# EAGLE design PCB (EAGLE 9.0.1)
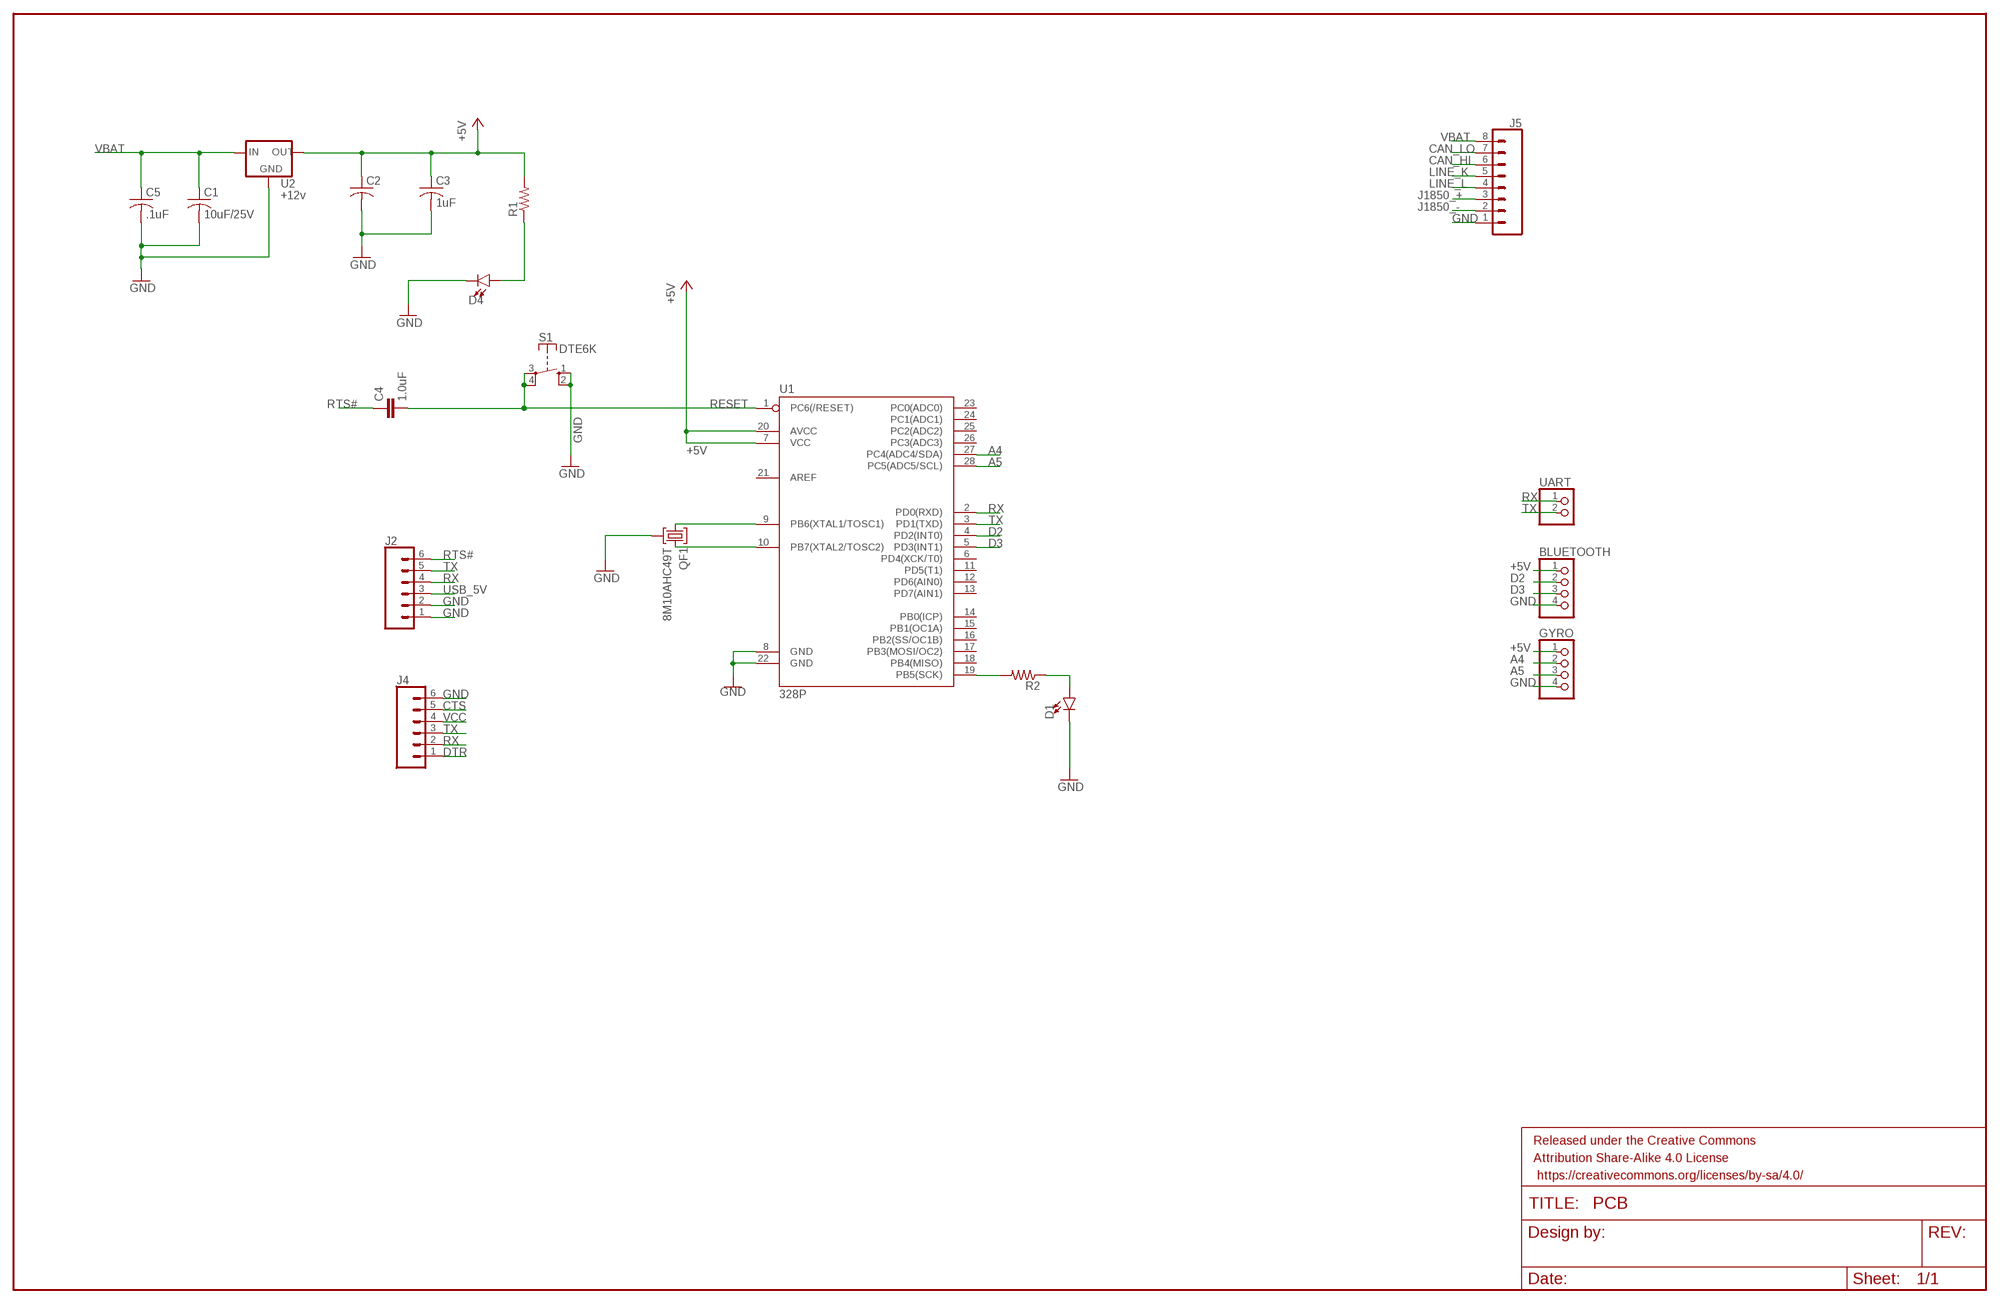
[diagram p0: schematic, sheet 1]

## Parts
BLUETOOTH  PINHD-1X4  [1X04]
C1  10uF/25V  C-US050-025X075  [C050-025X075]
C2  C-US050-025X075  [C050-025X075]
C3  1uF  C-US050-025X075  [C050-025X075]
C4  1.0uF  1.0UF-1206-50V-10%  [1206]
C5  .1uF  C-US050-025X075  [C050-025X075]
D1  LED3MM  [LED_3MM]
D4  LED3MM  [LED_3MM]
FRAME1  FRAME-LEDGER  [CREATIVE_COMMONS]
GYRO  PINHD-1X4  [1X04]
J2  CONN_06LONGPADS  [1X06_LONGPADS]
J4  CONN_06LONGPADS  [1X06_LONGPADS]
J5  CONN_08LONGPADS  [1X08_LONGPADS]
QF1  8M10AHC49T  [HC49U]
R1  R-US_0204/5  [0204/5]
R2  R-US_0204/5  [0204/5]
S1  DTE6K  [DTE6K]
U1  328P  ATMEGA328P_PDIP  [DIP28]
U2  +12v  V_REG_78XX7812  [TO-252]
UART  PINHD-1X2  [1X02]

## Nets
+5V: BLUETOOTH.1 C2.1 C3.1 GYRO.1 R1.2 U1.7(VCC) U1.20(AVCC) U2.2(OUT)
A4: GYRO.2 U1.27(PC4(ADC4/SDA))
A5: GYRO.3 U1.28(PC5(ADC5/SCL))
CAN_HI: J5.6
CAN_LO: J5.7
CTS: J4.5
D2: BLUETOOTH.2 U1.4(PD2(INT0))
D3: BLUETOOTH.3 U1.5(PD3(INT1))
DTR: J4.1
GND: BLUETOOTH.4 C1.2 C2.2 C3.2 C5.2 D1.K(C) D4.K(C) GYRO.4 J2.1 J2.2 J4.6 J5.1 QF1.2 S1.1(S) S1.2(S) U1.8(GND) U1.22(GND) U2.3(GND)
J1850_+: J5.3
J1850_-: J5.2
LINE_K: J5.5
LINE_L: J5.4
N$1: QF1.1 U1.9(PB6(XTAL1/TOSC1))
N$2: QF1.3 U1.10(PB7(XTAL2/TOSC2))
N$4: R2.2 U1.19(PB5(SCK))
N$5: D1.A R2.1
N$22: D4.A R1.1
RESET: C4.2 S1.3(P) S1.4(P) U1.1(PC6(/RESET))
RTS#: C4.1 J2.6
RX: J2.4 J4.2 U1.2(PD0(RXD)) UART.1
TX: J2.5 J4.3 U1.3(PD1(TXD)) UART.2
USB_5V: J2.3
VBAT: C1.1 C5.1 J5.8 U2.1(IN)
VCC: J4.4
Unconnected: U1.6(PD4(XCK/T0)) U1.11(PD5(T1)) U1.12(PD6(AIN0)) U1.13(PD7(AIN1)) U1.14(PB0(ICP)) U1.15(PB1(OC1A)) U1.16(PB2(SS/OC1B)) U1.17(PB3(MOSI/OC2)) U1.18(PB4(MISO)) U1.21(AREF) U1.23(PC0(ADC0)) U1.24(PC1(ADC1)) U1.25(PC2(ADC2)) U1.26(PC3(ADC3))

## Library data of the parts
BLUETOOTH GYRO = pinhead:PINHD-1X4: PIN HEADER
C1-C3 C5 = resistor:C-US: CAPACITOR, American symbol
C4 = SparkFun-Capacitors:1.0UF: 1µF ceramic capacitors A capacitor is a passive two-terminal electrical component used to store electrical energy temporarily in an electric field.; PROD_ID: CAP-09822
D1 D4 = SparkFun-LED:LED: LED (Generic) Standard schematic elements and footprints for 5mm, 3mm, 1206, and 0603 sized LEDs. Generic LEDs with no color specified.; PROD_ID: DIO-08794
FRAME1 = SparkFun-Aesthetics:FRAME-LEDGER: Schematic Frame - Ledger Standard 11x14 US Ledger frame
J2 J4 = SparkFun-Connectors:CONN_06: Multi connection point. Often used as Generic Header-pin footprint for 0.1 inch spaced/style header connections On any of the 0.1 inch spaced packages, you can populate with these: Break Away Headers - Straight <https://www.sparkfun.com/products/116> (PRT-00116) Break Away Male Headers - Right Angle <https://www.sparkfun.com/products/553> (PRT-00553) Female Headers <https://www.sparkfun.com/products/115> (PRT-00115) Break Away Headers - Machine Pin <https://www.sparkfun.com/products/117> (PRT-00117) Break Away Female Headers - Swiss Machine Pin <https://www.sparkfun.com/products/743> (PRT-00743) Arduino Stackable Header - 6 Pin <https://www.sparkfun.com/products/9280> (PRT-09280) For SCREWTERMINALS and SPRING TERMINALS visit here: Screw Terimnals on SparkFun.com <https://www.sparkfun.com/search/results?term=Screw+Terminals> (5mm/3.5mm/2.54mm spacing) This device is also useful as a general connection point to wire up your design to another part of your project. Our various solder wires solder well into these plated through hole pads. Hook-Up Wire - Assortment (Stranded, 22 AWG) <https://www.sparkfun.com/products/11375> (PRT-11375) Hook-Up Wire - Assortment (Solid Core, 22 AWG) <https://www.sparkfun.com/products/11367> (PRT-11367) View the entire wire category on our website here <https://www.sparkfun.com/categories/141>
J5 = SparkFun-Connectors:CONN_08: Multi connection point. Often used as Generic Header-pin footprint for 0.1 inch spaced/style header connections On any of the 0.1 inch spaced packages, you can populate with these: Break Away Headers - Straight <https://www.sparkfun.com/products/116> (PRT-00116) Break Away Male Headers - Right Angle <https://www.sparkfun.com/products/553> (PRT-00553) Female Headers <https://www.sparkfun.com/products/115> (PRT-00115) Break Away Headers - Machine Pin <https://www.sparkfun.com/products/117> (PRT-00117) Break Away Female Headers - Swiss Machine Pin <https://www.sparkfun.com/products/743> (PRT-00743) Arduino Stackable Header - 8 Pin <https://www.sparkfun.com/products/9279> (PRT-09279) For SCREWTERMINALS and SPRING TERMINALS visit here: Screw Terimnals on SparkFun.com <https://www.sparkfun.com/search/results?term=Screw+Terminals> (5mm/3.5mm/2.54mm spacing) This device is also useful as a general connection point to wire up your design to another part of your project. Our various solder wires solder well into these plated through hole pads. Hook-Up Wire - Assortment (Stranded, 22 AWG) <https://www.sparkfun.com/products/11375> (PRT-11375) Hook-Up Wire - Assortment (Solid Core, 22 AWG) <https://www.sparkfun.com/products/11367> (PRT-11367) View the entire wire category on our website here <https://www.sparkfun.com/categories/141> Special notes: Molex polarized connector foot print use with SKU : PRT-08231 with associated crimp pins and housings. 1MM SMD Version SKU: PRT-10208 NOTES ON THE VARIANTS LOCK and LOCK_LONGPADS... This footprint was designed to help hold the alignment of a through-hole component (i.e. 6-pin header) while soldering it into place. You may notice that each hole has been shifted either up or down by 0.005 of an inch from it's more standard position (which is a perfectly straight line). This slight alteration caused the pins (the squares in the middle) to touch the edges of the holes. Because they are alternating, it causes a "brace" to hold the component in place. 0.005 has proven to be the perfect amount of "off-center" position when using our standard breakaway headers. Although looks a little odd when you look at the bare footprint, once you have a header in there, the alteration is very hard to notice. Also,if you push a header all the way into place, it is covered up entirely on the bottom side.
QF1 = crystal:8M10AHC49T: Monolithic Crystal Filters Source: www.vanlong.com; OC_FARNELL: unknown; OC_NEWARK: unknown
R1 R2 = resistor:R-US_: RESISTOR, American symbol
S1 = switch-misc:DT: ITT SWITCH
U1 = SparkFun-IC-Microcontroller:ATMEGA328P_PDIP: Atmel 328P Through hole ATMEGA328P uC used in the Arduino 32kb flash, 1k EEPROM, 2k SRAM Datasheet <http://www.sparkfun.com/datasheets/Components/SMD/ATMega328.pdf> SparkFun Products Storefront component: AVR 28 Pin 20MHz 32K 6A/D - ATMega328P <https://www.sparkfun.com/products/9061> (COM-09061) SparkFun Simon Says - Through-Hole Soldering Kit <https://www.sparkfun.com/products/10547> (KIT-10547) SparkFun Learn to Solder - Simon Says <https://www.sparkfun.com/products/13708> (KIT-13708) SparkFun BigTime Watch Kit <https://www.sparkfun.com/products/11734> (KIT-11734) SparkFun ClockIt <https://www.sparkfun.com/products/10930> (KIT-10930) SparkFun Serial Enabled LCD Kit <https://www.sparkfun.com/products/10097> (LCD-10097) SparkFun Simon Tilts - Through Hole Soldering Kit <https://www.sparkfun.com/products/12634> (KIT-12634) SparkFun Frequency Counter Kit <https://www.sparkfun.com/products/10140> (KIT-10140) FabFM Radio Kit <https://www.sparkfun.com/products/11043> (KIT-11043) SparkFun Binary Blaster Kit <https://www.sparkfun.com/products/12037> (KIT-12037) SparkFun Metro-Gnome <https://www.sparkfun.com/products/9236> (KIT-09236) ATmega328 with Arduino Optiboot (Uno) <https://www.sparkfun.com/products/10524> (DEV-10524); PROD_ID: IC-09136
U2 = SparkFun-IC-Power:V_REG_78XX: Voltage Regulator Standard 78xx regulator. IGO (Input Ground Output). Spark Fun Electronics SKU : COM-00107; PROD_ID: VREG-12370
UART = pinhead:PINHD-1X2: PIN HEADER

## Board
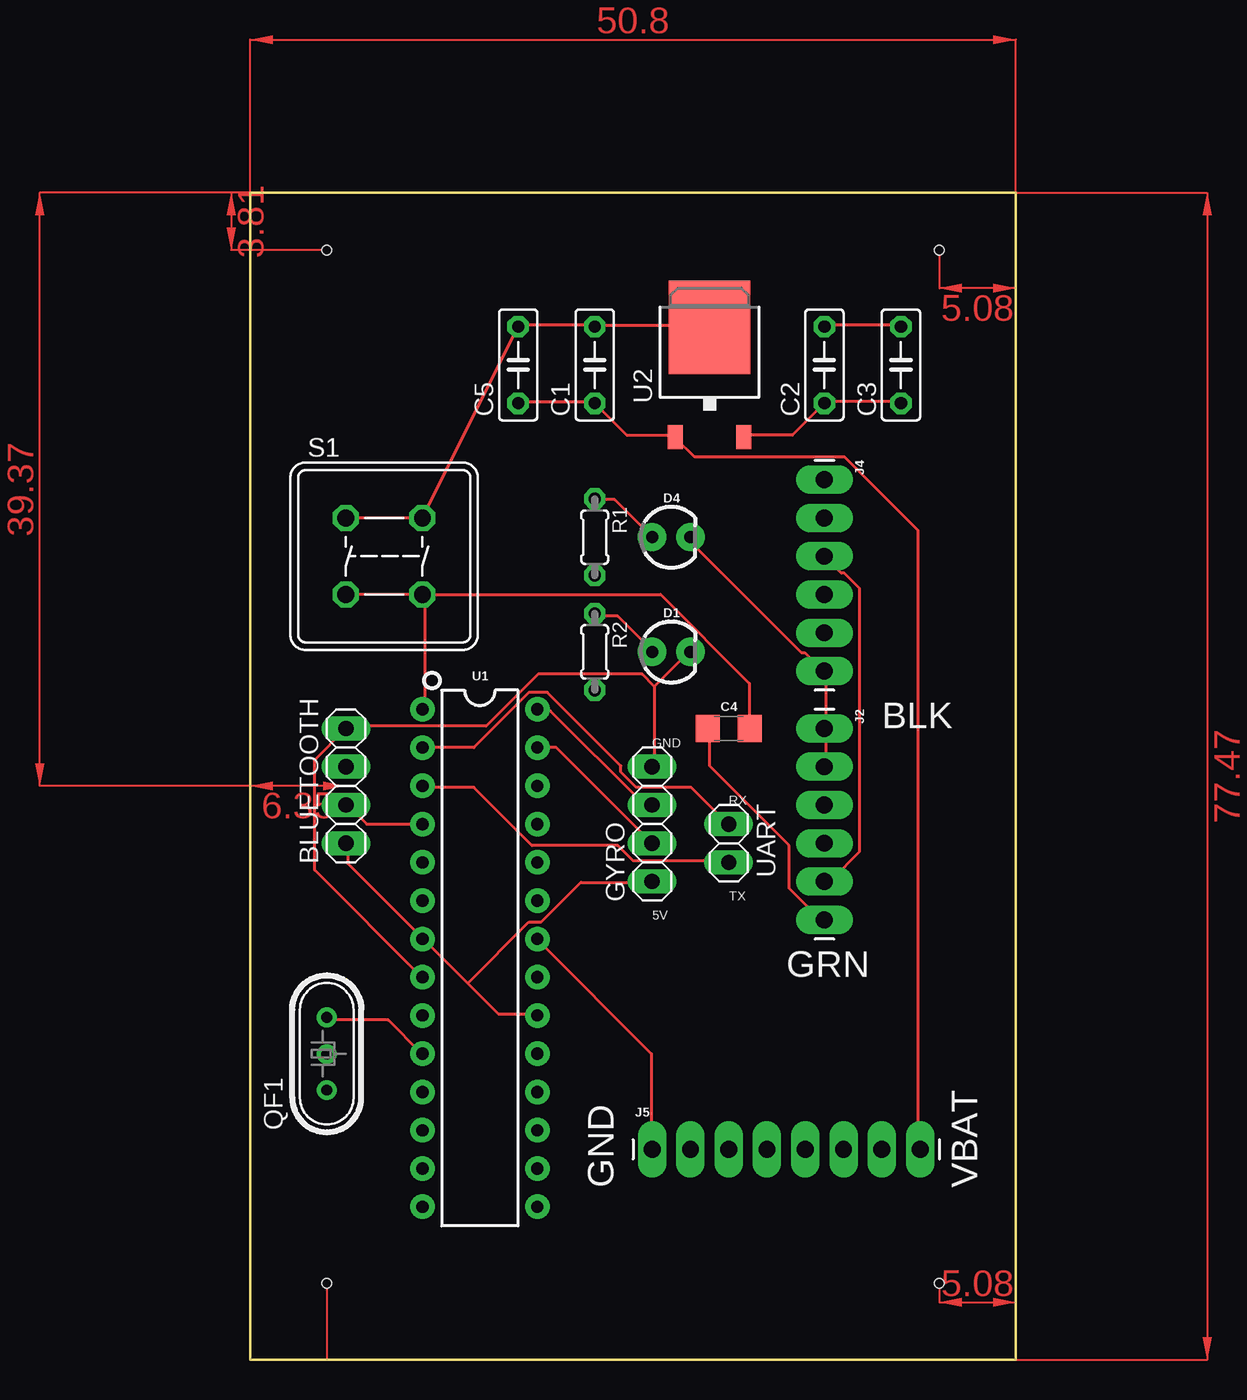
[diagram p1: board, top side]
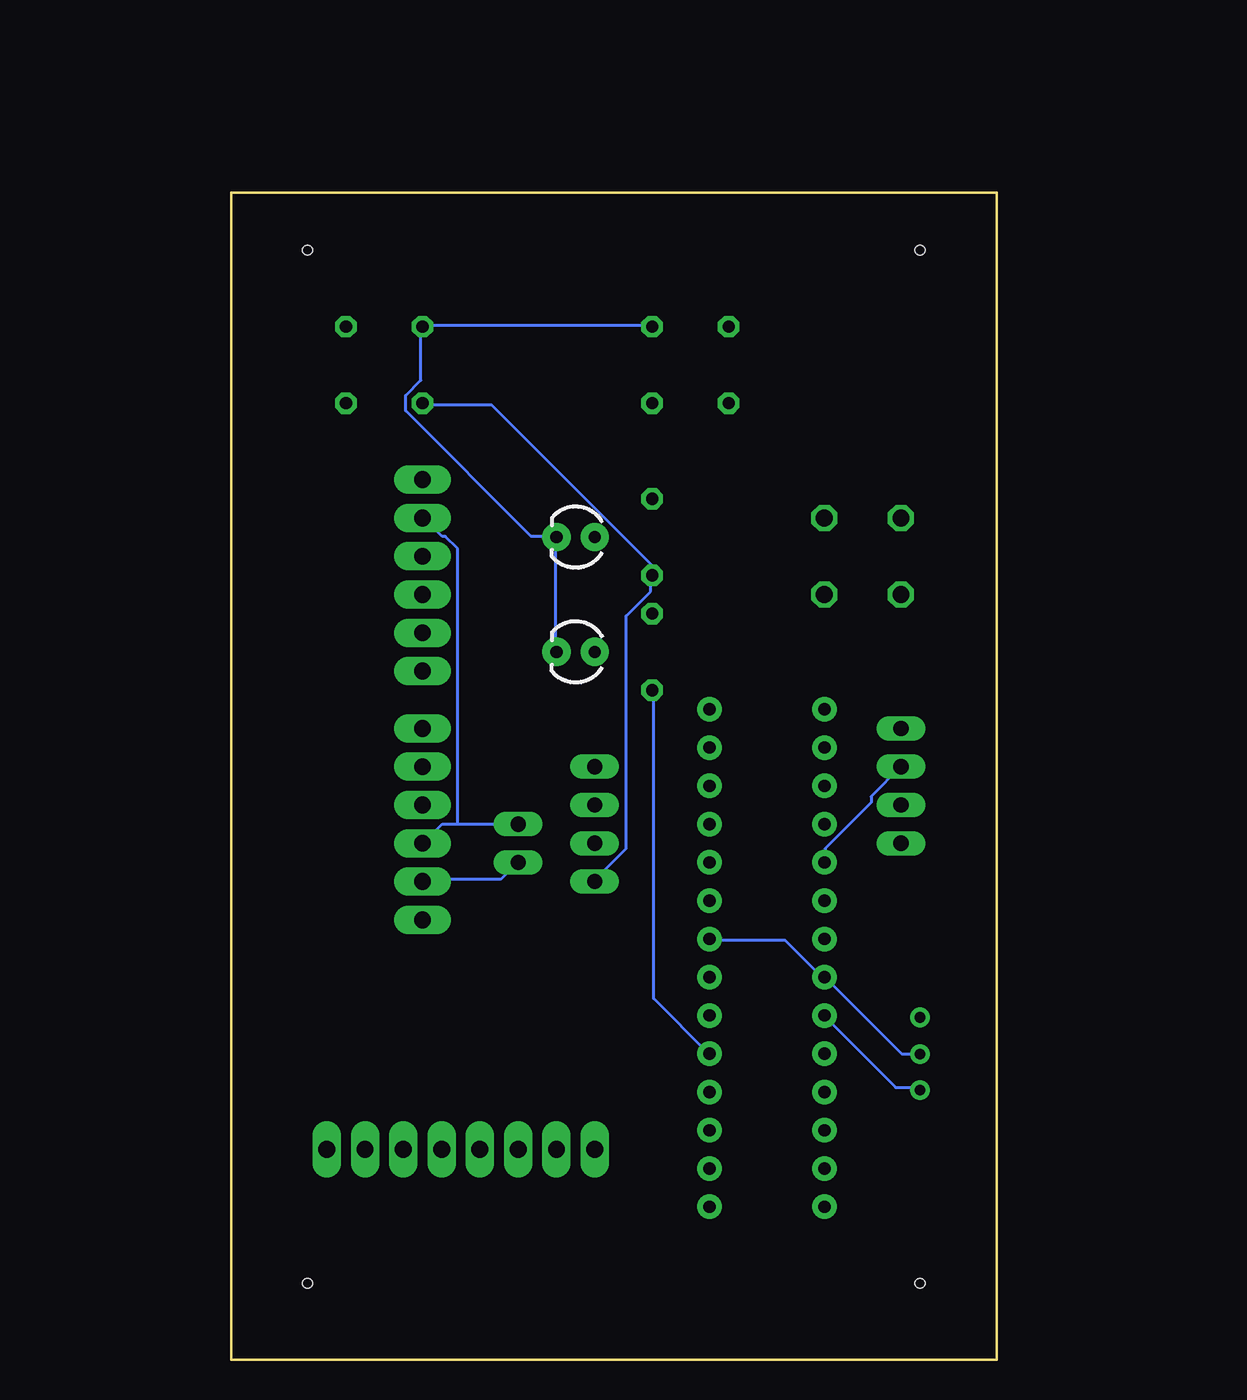
[diagram p2: board, bottom side, seen from below]

Size 50.8 x 77.47 mm. Coordinates in mm from the lower left corner, seen from the top.
Outline: 0,0 0,77.47 50.8,77.47 50.8,0 0,0
Copper layers (1*16): Top 0.035mm / dielectric 1.5mm / Bottom 0.035mm
Design rules "SparkFun": minimum track width 8mil, minimum drill 20mil, track to track 8mil, track to pad 8mil, pad to pad 8mil, via to via 8mil, smd to smd 8mil, copper to edge 8mil, drill to drill 8mil, minimum pad ring 12mil, minimum via ring 10mil, stop-mask expansion 4mil, vias tented up to drill 20mil, thermal gap 10mil
Holes 0.65 mm at 45.72,73.66 45.72,5.08 5.08,5.08 5.08,73.66

### Footprints (pad centres in the part's own frame; a part is rotated, then mirrored left to right if it is on the bottom)
1X04 = drill 1.016 long: 1 -3.81,0; 2 -1.27,0; 3 1.27,0; 4 3.81,0
C050-025X075 = drill 0.813 octagon: 1 -2.54,0; 2 2.54,0
1206 = smd 1.6 x 1.8: 1 -1.4,0; 2 1.4,0
LED_3MM = drill 0.813 pad 1.88: A -1.27,0; K 1.27,0
1X06_LONGPADS = drill 1.118 pad 1.88 long: 1 0,0; 2 2.54,0; 3 5.08,0; 4 7.62,0; 5 10.16,0; 6 12.7,0
1X08_LONGPADS = drill 1.118 pad 1.88 long: 1 0,0; 2 2.54,0; 3 5.08,0; 4 7.62,0; 5 10.16,0; 6 12.7,0; 7 15.24,0; 8 17.78,0
HC49U = drill 0.7 pad 1.2: 1 -2.413,0; 2 -0.027,0; 3 2.413,0
0204/5 = drill 0.813 octagon: 1 -2.54,0; 2 2.54,0
DTE6K = drill 1.118 octagon: 1 -2.54,2.54; 2 2.54,2.54; 3 2.54,-2.54; 4 -2.54,-2.54
DIP28 = drill 0.813 pad 1.626: 1 -16.51,-3.81; 2 -13.97,-3.81; 3 -11.43,-3.81; 4 -8.89,-3.81; 5 -6.35,-3.81; 6 -3.81,-3.81; 7 -1.27,-3.81; 8 1.27,-3.81; 9 3.81,-3.81; 10 6.35,-3.81; 11 8.89,-3.81; 12 11.43,-3.81; 13 13.97,-3.81; 14 16.51,-3.81; 15 16.51,3.81; 16 13.97,3.81; 17 11.43,3.81; 18 8.89,3.81; 19 6.35,3.81; 20 3.81,3.81; 21 1.27,3.81; 22 -1.27,3.81; 23 -3.81,3.81; 24 -6.35,3.81; 25 -8.89,3.81; 26 -11.43,3.81; 27 -13.97,3.81; 28 -16.51,3.81
TO-252 = smd 1 x 1.6: 1 -2.28,-4.8; 2 2.28,-4.8 | smd 5.4 x 6.2: 3 0,2.5
1X02 = drill 1.016 long: 1 -1.27,0; 2 1.27,0

### Placement (x,y rotation side)
BLUETOOTH  6.35,38.1 90 top
C1  22.86,66.04 90 top
C2  38.1,66.04 90 top
C3  43.18,66.04 90 top
C4  31.75,41.91 0 top
C5  17.78,66.04 90 top
D1  27.94,46.99 0 top
D4  27.94,54.61 0 top
FRAME1  -80.01,36.83 0 top  (outside the outline)
GYRO  26.67,35.56 90 top
J2  38.1,41.91 270 top
J4  38.1,58.42 270 top
J5  26.67,13.97 0 top
QF1  5.08,20.32 90 top
R1  22.86,54.61 270 top
R2  22.86,46.99 270 top
S1  8.89,53.34 0 top
U1  15.24,26.67 270 top
U2  30.48,66.04 0 top
UART  31.75,34.29 270 top

### Tracks (layer width: path | path; a pad name or v marks a point on that pad's centre or on a via)
+5V
  Top 0.203: U2.2 32.92,61.37 35.97,61.37 C2.1 38.2,63.6 43.08,63.6 C3.1 | BLUETOOTH.1 6.5,34.14 6.5,32.92 11.38,28.04 U1.7 11.58,27.84 14.43,24.99 | 14.43,24.99 16.46,22.96 18.9,22.96 U1.20 | 14.43,24.99 18.49,29.06 19.3,29.06 21.95,31.7 26.62,31.7 GYRO.1
  Bottom 0.203: C2.1 38,63.4 33.53,63.4 22.96,52.83 22.96,52.22 R1.2 22.96,52.02 22.96,51 24.59,49.38 24.59,33.93 26.62,31.9 GYRO.1
A4
  Top 0.203: U1.27 20.32,40.64 GYRO.2
A5
  Top 0.203: U1.28 19.1,43.08 19.91,43.08 26.01,36.98 26.62,36.98 GYRO.3
D2
  Top 0.203: U1.4 7.72,35.56 6.5,36.78 BLUETOOTH.2
D3
  Bottom 0.203: BLUETOOTH.3 8.33,37.39 8.33,36.98 11.38,33.93 11.38,33.12 U1.5
GND
  Top 0.203: 29.26,47.09 D1.K 29.06,46.94 26.82,44.7 | 29.26,54.56 D4.K 29.06,54.46 36.58,46.94 36.78,46.94 38,45.72 J4.6 38.2,45.72 38.2,42.06 J2.1 38.2,41.86 38.2,39.42 J2.2 | U1.8 11.38,25.4 4.27,32.51 4.27,39.83 BLUETOOTH.4 6.5,42.06 15.65,42.06 19.1,45.52 26.01,45.52 26.82,44.7 | J5.1 26.62,14.02 26.62,20.32 19.1,27.84 U1.22 | C2.2 38.2,68.68 43.08,68.68 C3.2 | 26.82,44.7 26.82,39.42 GYRO.4 | 11.43,55.93 S1.2 | S1.2 S1.1 | S1.2 C5.2 17.88,68.68 22.76,68.68 C1.2 22.96,68.68 30.48,68.68 U2.3
  Bottom 0.203: 38.1,39.47 J2.2 | QF1.2 5.08,20.32 6.3,20.32 11.38,25.4 U1.8 11.58,25.4 14.02,27.84 18.9,27.84 U1.22 | C1.2 22.96,68.68 38,68.68 C2.2 38.2,68.48 38.2,65.02 39.22,64.01 39.22,62.99 30.89,54.66 29.26,54.66 D4.K 29.26,54.46 29.26,47.14 D1.K
N$1
  Bottom 0.203: QF1.1 5.08,18.09 6.71,18.09 11.38,22.76 U1.9
N$2
  Top 0.203: 11.43,20.42 U1.10 11.38,20.32 9.14,22.55 5.08,22.55 QF1.3
N$4
  Top 0.203: 19.05,20.42 U1.19
  Bottom 0.203: R2.2 22.76,44.3 22.76,23.98 19.1,20.32 U1.19
N$5
  Top 0.203: R2.1 22.96,49.38 24.38,49.38 26.62,47.14 D1.A
N$22
  Top 0.203: D4.A 24.18,57.1 22.96,57.1 R1.1
RESET
  Top 0.203: 11.43,43.28 U1.1 11.58,43.28 11.58,50.8 | 11.58,50.8 27.23,50.8 33.12,44.91 33.12,42.06 C4.2 | 11.58,50.8 S1.3 S1.4
RTS#
  Top 0.203: J2.6 38,29.06 35.76,31.29 35.76,34.14 30.48,39.42 30.48,41.86 C4.1
RX
  Top 0.203: U1.2 14.83,40.64 18.49,44.3 19.71,44.3 24.59,39.42 24.59,39.01 25.6,38 29.26,38 31.7,35.56 UART.1
  Bottom 0.203: 11.43,40.54 U1.2 | 35.76,35.56 36.78,35.56 38,34.34 J2.4 | 35.76,35.56 UART.1 | 35.76,35.56 35.76,53.85 36.58,54.66 36.78,54.66 38,55.88 J4.2
TX
  Top 0.203: U1.3 11.58,38 14.83,38 18.69,34.14 24.38,34.14 25.4,33.12 31.7,33.12 UART.2 | J4.3 39.22,52.22 39.42,52.22 40.44,51.21 40.44,33.73 38.61,31.9 38.2,31.9 J2.5
  Bottom 0.203: UART.2 31.9,32.92 32.92,31.9 38,31.9 J2.5
VBAT
  Top 0.203: C5.1 17.88,63.6 22.76,63.6 C1.1 24.99,61.37 28.04,61.37 U2.1 28.25,61.16 29.46,59.94 39.42,59.94 44.3,55.07 44.3,14.02 J5.8
(copper drawn outside any net)
  shapes: Top area x8

### Text on the board
tPlace: BLK | GND | RX | TX | 5V | GRN | GND | VBAT